# Altium schematic sheet USB3300.SchDoc
size A4; DocumentNumber: 12; SheetNumber: 12; SheetTotal: 21; SheetName: USB 2.0 HS PHY
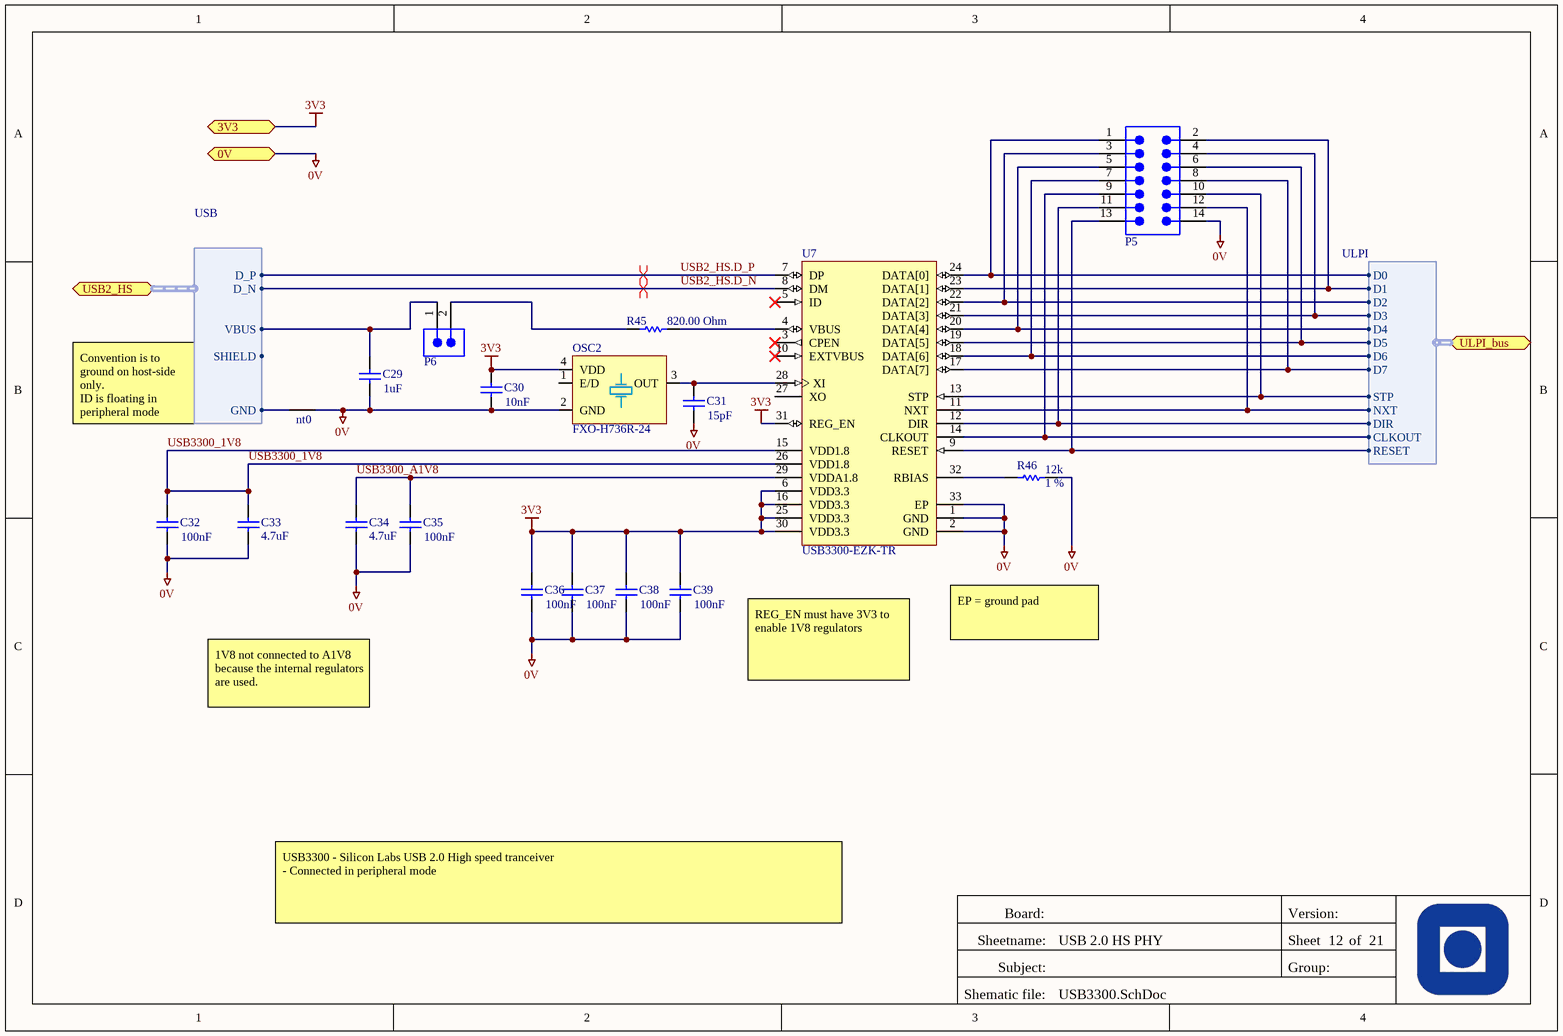
[diagram p0: USB3300.SchDoc]

## Parts
C29  value 1uF  [CAPC0603(1608)100_M]  (hidden comment: CAP 1uF 16V 0603(1608))
C30  value 10nF  [CAPC0603(1608)100_L]  (hidden comment: CAP 10nF 16V 0603(1608))
C31  value 15pF  [CAPC0603(1608)100_M]  (hidden comment: CAP 15pF 16V 0603(1608))
C32  value 100nF  [CAPC0603(1608)100_M]  (hidden comment: CAP 100nF 16V 0603(1608))
C33  value 4.7uF  [CAPC0603(1608)100_M]  (hidden comment: CAP 4.7uF 16V 0603(1608))
C34  value 4.7uF  [CAPC0603(1608)100_M]  (hidden comment: CAP 4.7uF 16V 0603(1608))
C35  value 100nF  [CAPC0603(1608)100_M]  (hidden comment: CAP 100nF 16V 0603(1608))
C36  value 100nF  [CAPC0603(1608)100_M]  (hidden comment: CAP 100nF 16V 0603(1608))
C37  value 100nF  [CAPC0603(1608)100_M]  (hidden comment: CAP 100nF 16V 0603(1608))
C38  value 100nF  [CAPC0603(1608)100_M]  (hidden comment: CAP 100nF 16V 0603(1608))
C39  value 100nF  [CAPC0603(1608)100_M]  (hidden comment: CAP 100nF 16V 0603(1608))
nt0  net tie  [net tie]  (value not drawn)  (net tie, no BOM)
OSC2  FXO-H736R-24  [FXO-HC73]
P5  HTSW-107-42-F-D  [SMTC-HTSW-107-42-X-D]  (value not drawn)
P6  TSW-102-26-L-S  [SMTC-TSW-102-26-XX-S]  (value not drawn)
R45  value 820.00 Ohm  [RESC0603(1608)_N]  (hidden comment: 820R 5% 0603(1608))
R46  value 12k  Tolerance: 1 %  [RESC0603(1608)_L]  (hidden comment: 12K 1% 0603(1608))
U7  USB3300-EZK-TR  [MCHP-QFN-32-5x5_V2]

## Ports
0V, 3V3, ULPI_bus (harness ULPI), USB2_HS (harness USB)

## Harnesses
ULPI: D0, D1, D2, D3, D4, D5, D6, D7, CLKOUT, STP, DIR, NXT, RESET
USB: D_P, D_N, VBUS, GND, SHIELD

## Nets
0V: C29.1 C30.1 C31.1 C32.1 C33.1 C34.1 C35.1 C36.1 C37.1 C38.1 C39.1 nt0.1 OSC2.2(GND) P5.14 R46.2 U7.1(GND) U7.2(GND) U7.33(EP) ; port 0V
3V3: C30.2 C36.2 C37.2 C38.2 C39.2 OSC2.4(VDD) U7.6(VDD3.3) U7.16(VDD3.3) U7.25(VDD3.3) U7.30(VDD3.3) U7.31(REG_EN) ; port 3V3
USB2_HS.D_N: U7.8(DM) ; port USB2_HS.D_N
USB2_HS.D_P: U7.7(DP) ; port USB2_HS.D_P
USB3300_1V8: C32.2 C33.2 U7.15(VDD1.8) U7.26(VDD1.8)
USB3300_A1V8: C34.2 C35.2 U7.29(VDDA1.8)
NetC29_2: C29.2 P6.1 ; port USB2_HS.VBUS
NetC31_2: C31.2 OSC2.3(OUT) U7.28(XI)
Netnt0_0: nt0.0 ; port USB2_HS.GND
NetP5_1: P5.1 U7.24(DATA[0]) ; port ULPI_bus.D0
NetP5_2: P5.2 U7.23(DATA[1]) ; port ULPI_bus.D1
NetP5_3: P5.3 U7.22(DATA[2]) ; port ULPI_bus.D2
NetP5_4: P5.4 U7.21(DATA[3]) ; port ULPI_bus.D3
NetP5_5: P5.5 U7.20(DATA[4]) ; port ULPI_bus.D4
NetP5_6: P5.6 U7.19(DATA[5]) ; port ULPI_bus.D5
NetP5_7: P5.7 U7.18(DATA[6]) ; port ULPI_bus.D6
NetP5_8: P5.8 U7.17(DATA[7]) ; port ULPI_bus.D7
NetP5_9: P5.9 U7.14(CLKOUT) ; port ULPI_bus.CLKOUT
NetP5_10: P5.10 U7.13(STP) ; port ULPI_bus.STP
NetP5_11: P5.11 U7.12(DIR) ; port ULPI_bus.DIR
NetP5_12: P5.12 U7.11(NXT) ; port ULPI_bus.NXT
NetP5_13: P5.13 U7.9(RESET) ; port ULPI_bus.RESET
NetP6_2: P6.2 R45.1
NetR45_2: R45.2 U7.4(VBUS)
NetR46_1: R46.1 U7.32(RBIAS)

Not connected (* = marked no-connect by the designer): OSC2 1(E/D); U7 3(CPEN)* 5(ID)* 10(EXTVBUS)* 27(XO)

## Layout directives
differential pair: USB2_HS.D_N, USB2_HS.D_P

## Notes on the sheet
- Convention is to ground on host-side only.
  ID is floating in peripheral mode
- EP = ground pad
- 1V8 not connected to A1V8 because the internal regulators are used.
- REG_EN must have 3V3 to enable 1V8 regulators
- USB3300 - Silicon Labs USB 2.0 High speed tranceiver
  - Connected in peripheral mode
- Board:
- Version:
- Sheetname:
- Subject:
- Group:
- Sheet
- of
- Shematic file:

## Library data of the parts
C29 = CMP-1035-02736-1: CAP 1uF 16V ±5% 0603 (1608 Metric) Thickness 1mm SMD; Case-Metric: 1608; Case-EIA: 0603; Tolerance: Â±5%; Technology: SMT; Max Thickness: 1 mm; Rated Voltage: 16 V
C30 = CMP-1035-02309-1: CAP 10nF 16V ±1% 0603 (1608 Metric) Thickness 1mm SMD; Case-Metric: 1608; Tolerance: Â±1%; Case-EIA: 0603; Rated Voltage: 16 V; Technology: SMT; Max Thickness: 1 mm
C31 = CMP-1035-00665-1: CAP 15pF 16V ±0.25pF 0603 (1608 Metric) Thickness 1mm SMD; Case-Metric: 1608; Case-EIA: 0603; Tolerance: Â±0.25pF; Technology: SMT; Max Thickness: 1 mm; Rated Voltage: 16 V
C32 C35-C39 = CMP-1035-02583-1: CAP 100nF 16V ±5% 0603 (1608 Metric) Thickness 1mm SMD; Tolerance: Â±5%; Case-Metric: 1608; Case-EIA: 0603; Rated Voltage: 16 V; Max Thickness: 1 mm; Technology: SMT
C33 C34 = CMP-1035-02788-1: CAP 4.7uF 16V ±10% 0603 (1608 Metric) Thickness 1mm SMD; Case-Metric: 1608; Tolerance: Â±10%; Case-EIA: 0603; Technology: SMT; Rated Voltage: 16 V; Max Thickness: 1 mm
nt0 = net tie: used to connect nets without transferring net name
P5 = CMP-1024-00062-1: Manufacturer: Samtec; Pitch: 2.54 mm; Temperature Range: -55 to 125 degC; ComponentLink1URL: http://www.samtec.com; RoHS: True; PartNumber: HTSW-107-42-F-D; ComponentLink3Description: Package Specification; ComponentLink3URL: http://www.samtec.com/documents/webfiles/cpdf/HTSW-XXX-XX-XXX-X-XX-XX-XX-MKT.pdf; DatasheetVersion: F-214; Mounting Technology: Through-hole; PackageReference: HTSW-107-42-X-D; ComponentLink1Description: Manufacturer URL; PackageDescription: .025 SQ Post Hi-Temp Terminal Strip Assembly; ComponentLink2URL: http://www.samtec.com/documents/webfiles/pdf/HTSW_TH.PDF; Orientation: Vertical; PackageVersion: BO, 2/1987; ComponentLink2Description: Datasheet
P6 = CMP-1024-00330-1: 0.025" SQ Post Header, Through-hole, Vertical, -55 to 125 degC, 2.54 mm Pitch, 2-Pin, Male, RoHS; Manufacturer: Samtec; Pitch: 2.54 mm; DatasheetVersion: F-214; PackageReference: TSW-102-26-XX-S; ComponentLink3Description: Package Specification; PackageDescription: .025[0.64] SQ. Post Terminal Strip Assembly; PackageVersion: DM, 8/1988; ComponentLink1Description: Manufacturer URL; ComponentLink2URL: http://www.samtec.com/documents/webfiles/pdf/TSW_TH.PDF; ComponentLink3URL: http://www.samtec.com/documents/webfiles/cpdf/TSW-XXX-XX-XXX-X-XX-XXX-MKT.pdf; ComponentLink2Description: Datasheet; Temperature Range: -55 to 125 degC; Mounting Technology: Through-hole; ComponentLink1URL: http://www.samtec.com; RoHS: True; PartNumber: TSW-102-26-L-S; Orientation: Vertical
R45 = CMP-1012-00072-1: 820R 0.1W 5% 0603 (1608 Metric)  SMD; Case-EIA: 0603; Case-Metric: 1608; Tolerance: 5 %; Power: 0.1 W; Technology: SMT
R46 = CMP-1012-00631-1: 12K 0.1W 1% 0603 (1608 Metric)  SMD; Case-EIA: 0603; Case-Metric: 1608; Technology: SMT; Power: 0.1 W
U7 = CMP-0186-00339-1: Hi-Speed USB Host, Device or OTG PHY with ULPI Low Pin Interface, 5 pF, -40 to 85 degC, 32-Pin QFN (QFN-3304), RoHS, Tape and Reel; CI: 5 pF; ComponentLink3URL: http://ww1.microchip.com/downloads/en/DeviceDoc/8710a.pdf; DatasheetVersion: DS00001783B; Code_JEDEC: MO-220; Mounting Technology: Surface Mount; ComponentLink2URL: http://ww1.microchip.com/downloads/en/DeviceDoc/00001783B.pdf; Temperature Min: -40 degC; Temperature Max: 85 degC; ComponentLink2Description: Datasheet; RoHS: TRUE; PackageVersion: Rev. H, 07/2004; Generic Part Number: USB3300; ComponentLink1URL: http://www.microchip.com/; PackageDescription: 32-Pin Quad Flat Non-Leaded Package, Body 5 x 5 mm, Pitch 0.5 mm; ComponentLink3Description: Package Specification; ComponentLink1Description: Manufacturer URL; Packing: Tape and Reel; PartNumber: USB3300-EZK-TR
OSC2 = FXO-H736R-24: Supplier 1: Digi-Key; Supplier Part Number 1: 631-1185-1-ND